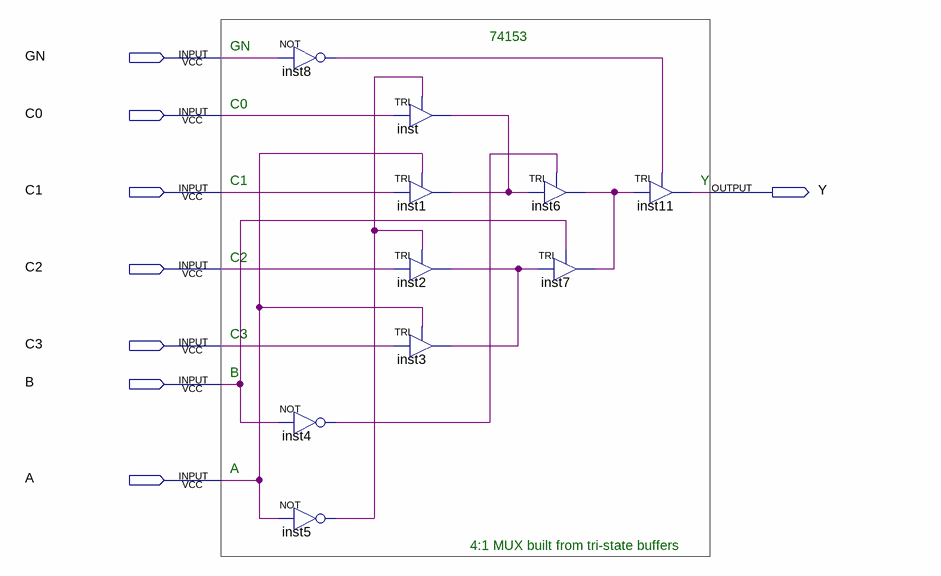
[diagram p0: schematic sheet]
// Quartus schematic AlmostMux74153.bdf as structural Verilog: 10 symbols, 8 pins
module AlmostMux74153 (
  input  GN,
  input  C0,
  input  C1,
  input  C2,
  input  C3,
  input  B,
  input  A,
  output Y
);

  wire inst2_out, inst4_out, inst5_out, inst6_out, inst8_out, inst_out;

  not inst8 (inst8_out, GN);
  not inst4 (inst4_out, B);
  not inst5 (inst5_out, A);
  TRI inst (.IN(C0), .OE(inst5_out), .OUT(inst_out));
  TRI inst1 (.IN(C1), .OE(A), .OUT(inst_out));
  TRI inst2 (.IN(C2), .OE(inst5_out), .OUT(inst2_out));
  TRI inst3 (.IN(C3), .OE(A), .OUT(inst2_out));
  TRI inst6 (.IN(inst_out), .OE(inst4_out), .OUT(inst6_out));
  TRI inst7 (.IN(inst2_out), .OE(B), .OUT(inst6_out));
  TRI inst11 (.IN(inst6_out), .OE(inst8_out), .OUT(Y));

  // Notes on the sheet:
  //   74153
  //   GN
  //   C0
  //   C1
  //   Y
  //   C2
  //   C3
  //   B
  //   A
  //   4:1 MUX built from tri-state buffers
endmodule
